# Altium project Amp_8ch.PrjPcb
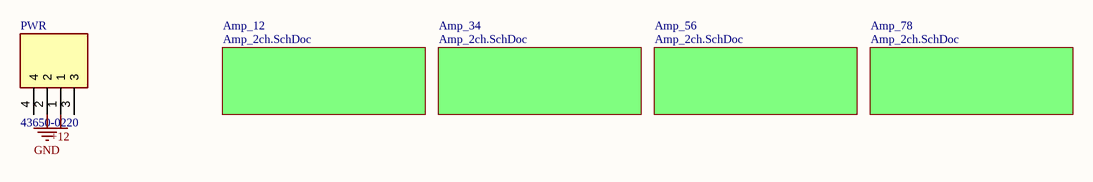
[diagram p0: Amp_8ch.SchDoc]
2 sheets, 61 parts. Net scope: hierarchical (ports join the sheet entries above them; power ports are global).
Board file: Amp_8ch.PcbDoc
Sheets:
  Amp_8ch.SchDoc
    Amp_12 = Amp_2ch.SchDoc
    Amp_34 = Amp_2ch.SchDoc
    Amp_56 = Amp_2ch.SchDoc
    Amp_78 = Amp_2ch.SchDoc

## Sheet Amp_8ch.SchDoc
size 594 x 420 mm; SheetNumber: 1; SheetTotal: 2

### Parts
PWR  43650-0220  [43650-02YY_18192063]

### Sub-sheets
Amp_12 = Amp_2ch.SchDoc: no entries
Amp_34 = Amp_2ch.SchDoc: no entries
Amp_56 = Amp_2ch.SchDoc: no entries
Amp_78 = Amp_2ch.SchDoc: no entries

### Nets
+12: PWR.1
GND: PWR.2

Not connected (* = marked no-connect by the designer): PWR 3 4

### Notes on the sheet
- DWG NO:
- REV:
- THIS DOCUMENT AND THE DATA DISCLOSED HEREIN OR
- HEREWITH IS THE PROPERTY OF ALTIUM LIMITED AND MAY
- BE FREELY DISTRIBUTED IN WHOLE. NO RIGHTS ARE
- RESERVED OR EXPRESS OR IMPLIED WARANTEE GIVEN.
- REVISION
- DESCRIPTION
- DATE
- APPROVED
- ENG:
- APPROVALS
- PROJECT
- DSN:
- CHK:
- REFERENCE DOCUMENTS
- PROJECT REVISION:
- TITLE
- DOCUMENT REVISION:
- DESIGN ITEM:
- BOM:
- FAB DWG:
- PCB DWG:
- ASSY DWG:
- SCALE:
- A2
- SIZE
- CAGE CODE
- FILE NAME
- DWG NO.
- SHEET
- OF
- REV

### Library data of the parts
PWR = 43650-0220: Connector; Manufacturer_Name: Molex; Datasheet Link: https://www.molex.com/pdm_docs/sd/436500218_sd.pdf; Height: 9.9mm; Manufacturer_Part_Number: 43650-0220; Mouser Part Number: 538-43650-0220; Mouser Price/Stock: https://www.mouser.co.uk/ProductDetail/Molex/43650-0220?qs=zhePCb1yaFPcr0mO6F%252BhcQ%3D%3D

## Sheet Amp_2ch.SchDoc
size A; SheetNumber: 2; SheetTotal: 2
Used 4 times, as channels Amp_12, Amp_34, Amp_56, Amp_78. Parts and nets are listed once, with the designators drawn on the sheet.
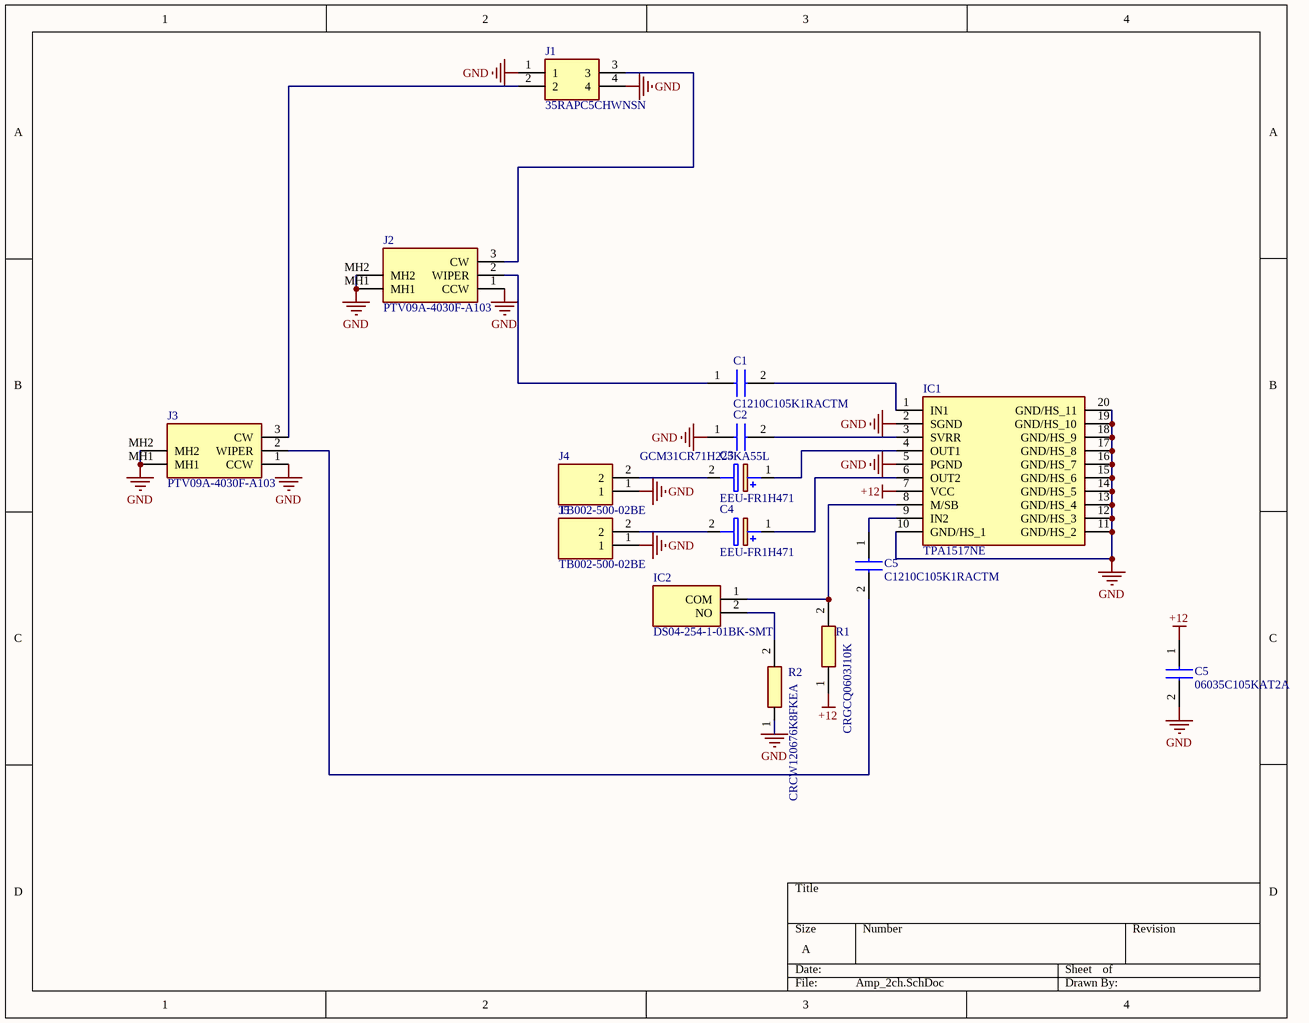
[diagram p1: Amp_2ch.SchDoc]

### Parts
(Parts that share a designator on the sheet are numbered #1, #2 ... from top to bottom, then left to right.)
C1  C1210C105K1RACTM  [C1210]
C2  GCM31CR71H225KA55L  [CAPC3116X180N]
C3  EEU-FR1H471  [CAPPRD500W65D1250H2200]
C4  EEU-FR1H471  [CAPPRD500W65D1250H2200]
C5#1  C1210C105K1RACTM  [C1210]
C5#2  06035C105KAT2A  [CAPC1608X90N]
IC1  TPA1517NE  [DIP762W53P254L2400H508Q20N]
IC2  DS04-254-1-01BK-SMT  [DS04254101BKSMT]
J1  35RAPC5CHWNSN  [35RAPC5CHWNSN]
J2  PTV09A-4030F-A103  [PTV09A4030FA103]
J3  PTV09A-4030F-A103  [PTV09A4030FA103]
J4  TB002-500-02BE  [TB00250002BE]
J5  TB002-500-02BE  [TB00250002BE]
R1  CRGCQ0603J10K  [RESC1608X55N]
R2  CRCW120676K8FKEA  [RESC3216X60N]

### Nets
+12: C5#2.1 IC1.7(VCC) R1.1
GND: C2.1 C5#2.2 IC1.2(SGND) IC1.5(PGND) IC1.10(GND/HS_1) IC1.11(GND/HS_2) IC1.12(GND/HS_3) IC1.13(GND/HS_4) IC1.14(GND/HS_5) IC1.15(GND/HS_6) IC1.16(GND/HS_7) IC1.17(GND/HS_8) IC1.18(GND/HS_9) IC1.19(GND/HS_10) IC1.20(GND/HS_11) J1.1 J1.4 J2.1(CCW) J2.MH1 J2.MH2 J3.1(CCW) J3.MH1 J3.MH2 J4.1 J5.1 R2.1
NetC1_1: C1.1 J2.2(WIPER)
NetC1_2: C1.2 IC1.1(IN1)
NetC2_2: C2.2 IC1.3(SVRR)
NetC3_1: C3.1(+) IC1.4(OUT1)
NetC3_2: C3.2(-) J4.2
NetC4_1: C4.1(+) IC1.6(OUT2)
NetC4_2: C4.2(-) J5.2
NetC5#1_1: C5#1.1 IC1.9(IN2)
NetC5#1_2: C5#1.2 J3.2(WIPER)
NetIC1_8: IC1.8(M/SB) IC2.1(COM) R1.2
NetIC2_2: IC2.2(NO) R2.2
NetJ1_2: J1.2 J3.3(CW)
NetJ1_3: J1.3 J2.3(CW)

### Channels
Amp_12: designators C1=C1_Amp_12 C2=C2_Amp_12 C3=C3_Amp_12 C4=C4_Amp_12 C5=C5_Amp_12#1 C5=C5_Amp_12#2 IC1=IC1_Amp_12 IC2=IC2_Amp_12 J1=J1_Amp_12 J2=J2_Amp_12 J3=J3_Amp_12 J4=J4_Amp_12 J5=J5_Amp_12 R1=R1_Amp_12 R2=R2_Amp_12
Amp_34: designators C1=C1_Amp_34 C2=C2_Amp_34 C3=C3_Amp_34 C4=C4_Amp_34 C5=C5_Amp_34#1 C5=C5_Amp_34#2 IC1=IC1_Amp_34 IC2=IC2_Amp_34 J1=J1_Amp_34 J2=J2_Amp_34 J3=J3_Amp_34 J4=J4_Amp_34 J5=J5_Amp_34 R1=R1_Amp_34 R2=R2_Amp_34
Amp_56: designators C1=C1_Amp_56 C2=C2_Amp_56 C3=C3_Amp_56 C4=C4_Amp_56 C5=C5_Amp_56#1 C5=C5_Amp_56#2 IC1=IC1_Amp_56 IC2=IC2_Amp_56 J1=J1_Amp_56 J2=J2_Amp_56 J3=J3_Amp_56 J4=J4_Amp_56 J5=J5_Amp_56 R1=R1_Amp_56 R2=R2_Amp_56
Amp_78: designators C1=C1_Amp_78 C2=C2_Amp_78 C3=C3_Amp_78 C4=C4_Amp_78 C5=C5_Amp_78#1 C5=C5_Amp_78#2 IC1=IC1_Amp_78 IC2=IC2_Amp_78 J1=J1_Amp_78 J2=J2_Amp_78 J3=J3_Amp_78 J4=J4_Amp_78 J5=J5_Amp_78 R1=R1_Amp_78 R2=R2_Amp_78

### Library data of the parts
C1 C5#1 = C1210C105K1RACTM: Capacitor; Manufacturer_Name: KEMET; Datasheet Link: https://content.kemet.com/datasheets/KEM_C1002_X7R_SMD.pdf; Manufacturer_Part_Number: C1210C105K1RACTM; Mouser Part Number: 80-C1210C105K1RACTM; Mouser Price/Stock: https://www.mouser.co.uk/ProductDetail/KEMET/C1210C105K1RACTM?qs=gt1LBUVyoHkoe6sHAWmw2Q%3D%3D; Arrow Part Number: C1210C105K1RACTM; Arrow Price/Stock: https://www.arrow.com/en/products/c1210c105k1ractm/kemet-corporation?region=nac
C2 = GCM31CR71H225KA55L: Capacitor; Manufacturer_Name: Murata Electronics; Datasheet Link: https://psearch.en.murata.com/capacitor/product/GCM31CR71H225KA55%23.html; Height: 1.8mm; Manufacturer_Part_Number: GCM31CR71H225KA55L; Mouser Part Number: 81-GCM31CR71H225KA5L; Mouser Price/Stock: https://www.mouser.co.uk/ProductDetail/Murata-Electronics/GCM31CR71H225KA55L?qs=aEuGZpxfbxXH69FledLqTA%3D%3D; Arrow Part Number: GCM31CR71H225KA55L; Arrow Price/Stock: https://www.arrow.com/en/products/gcm31cr71h225ka55l/murata-manufacturing?region=nac
C3 C4 = EEU-FR1H471: Capacitor Polarised; Manufacturer_Name: Panasonic; Datasheet Link: http://industrial.panasonic.com/cdbs/www-data/pdf/RDF0000/ABA0000C1259.pdf; Height: 22mm; Manufacturer_Part_Number: EEU-FR1H471; Mouser Part Number: 667-EEU-FR1H471; Mouser Price/Stock: https://www.mouser.co.uk/ProductDetail/Panasonic/EEU-FR1H471?qs=Uw8ySfEHS7JTqHno%252BakBKA%3D%3D
C5#2 = 06035C105KAT2A: Capacitor; Manufacturer_Name: AVX; Datasheet Link: https://componentsearchengine.com/Datasheets/1/06031A100FAT2A.pdf; Height: 0.9mm; Manufacturer_Part_Number: 06035C105KAT2A; Mouser Part Number: 581-06035C105KAT2A; Mouser Price/Stock: https://www.mouser.co.uk/ProductDetail/AVX/06035C105KAT2A/?qs=%252BdQmOuGyFcGCdIIWh6fU7Q%3D%3D; Arrow Part Number: 06035C105KAT2A; Arrow Price/Stock: https://www.arrow.com/en/products/06035c105kat2a/avx
IC1 = TPA1517NE: Integrated Circuit; Manufacturer_Name: Texas Instruments; Datasheet Link: http://www.ti.com/lit/gpn/tpa1517; Height: 5.08mm; Manufacturer_Part_Number: TPA1517NE; Mouser Part Number: 595-TPA1517NE; Mouser Price/Stock: https://www.mouser.co.uk/ProductDetail/Texas-Instruments/TPA1517NE?qs=5nGYs9Do7G0VZ0L%2FTRBsQw%3D%3D; Arrow Part Number: TPA1517NE; Arrow Price/Stock: https://www.arrow.com/en/products/tpa1517ne/texas-instruments?region=nac
IC2 = DS04-254-1-01BK-SMT: Integrated Circuit; Manufacturer_Name: CUI Devices; Datasheet Link: https://www.cuidevices.com/product/resource/digikeypdf/ds04-254-smt.pdf; Height: 4.3mm; Manufacturer_Part_Number: DS04-254-1-01BK-SMT; Mouser Part Number: 490-DS04254101BK-SMT; Mouser Price/Stock: https://www.mouser.co.uk/ProductDetail/CUI-Devices/DS04-254-1-01BK-SMT?qs=wnTfsH77Xs40YtszDww4tg%3D%3D; Arrow Part Number: DS04-254-1-01BK-SMT; Arrow Price/Stock: https://www.arrow.com/en/products/ds04-254-1-01bk-smt/cui-devices?region=nac
J1 = 35RAPC5CHWNSN: Connector; Manufacturer_Name: Switchcraft; Datasheet Link: https://www.switchcraft.com/assets/1/6/35RAPC5CHWNSN_CD.pdf; Height: 5.5mm; Manufacturer_Part_Number: 35RAPC5CHWNSN; Mouser Part Number: 502-35RAPC5CHWNSN; Mouser Price/Stock: https://www.mouser.co.uk/ProductDetail/Switchcraft/35RAPC5CHWNSN?qs=tlsG%2FOw5FFhDrydSbX%252BonQ%3D%3D
J2 J3 = PTV09A-4030F-A103: Connector; Manufacturer_Name: Bourns; Datasheet Link: https://componentsearchengine.com/Datasheets/1/PTV09A-4030F-A103.pdf; Height: 30.5mm; Manufacturer_Part_Number: PTV09A-4030F-A103; Mouser Part Number: 652-PTV09A-4030FA103; Mouser Price/Stock: https://www.mouser.co.uk/ProductDetail/Bourns/PTV09A-4030F-A103?qs=BJlw7L4Cy79aPKOjvTfpfw%3D%3D
J4 J5 = TB002-500-02BE: Connector; Manufacturer_Name: CUI Devices; Datasheet Link: https://eu.mouser.com/datasheet/2/670/tb002_500-1550579.pdf; Height: 10.4mm; Manufacturer_Part_Number: TB002-500-02BE; Mouser Part Number: 490-TB002-500-02BE; Mouser Price/Stock: https://www.mouser.co.uk/ProductDetail/CUI-Devices/TB002-500-02BE?qs=vLWxofP3U2x9716kcgva%2Fw%3D%3D; Arrow Part Number: TB002-500-02BE; Arrow Price/Stock: https://www.arrow.com/en/products/tb002-500-02be/cui-devices?region=nac
R1 = CRGCQ0603J10K: Resistor; Manufacturer_Name: TE Connectivity; Datasheet Link: https://4donline.ihs.com/images/VipMasterIC/IC/TYEL/TYEL-S-A0004929575/TYEL-S-A0004929575-1.pdf?hkey=52A5661711E402568146F3353EA87419; Height: 0.55mm; Manufacturer_Part_Number: CRGCQ0603J10K; Mouser Part Number: 279-CRGCQ0603J10K; Mouser Price/Stock: https://www.mouser.co.uk/ProductDetail/TE-Connectivity-Holsworthy/CRGCQ0603J10K?qs=wUXugUrL1qzulhGjUR%2FJ4g%3D%3D
R2 = CRCW120676K8FKEA: Resistor; Manufacturer_Name: Vishay; Datasheet Link: http://componentsearchengine.com/Datasheets/1/CRCW120676K8FKEA.pdf; Height: 0.6mm; Manufacturer_Part_Number: CRCW120676K8FKEA; Mouser Part Number: 71-CRCW1206-76.8K-E3; Mouser Price/Stock: https://www.mouser.com/Search/Refine.aspx?Keyword=71-CRCW1206-76.8K-E3

## Nets that join several sheets
+12: Amp_8ch (PWR.1), Amp_12 (C5_Amp_12#2.1 IC1_Amp_12.7 R1_Amp_12.1), Amp_34 (C5_Amp_34#2.1 IC1_Amp_34.7 R1_Amp_34.1), Amp_56 (C5_Amp_56#2.1 IC1_Amp_56.7 R1_Amp_56.1), Amp_78 (C5_Amp_78#2.1 IC1_Amp_78.7 R1_Amp_78.1)
GND: Amp_8ch (PWR.2), Amp_12 (26 pins), Amp_34 (26 pins), Amp_56 (26 pins), Amp_78 (26 pins)